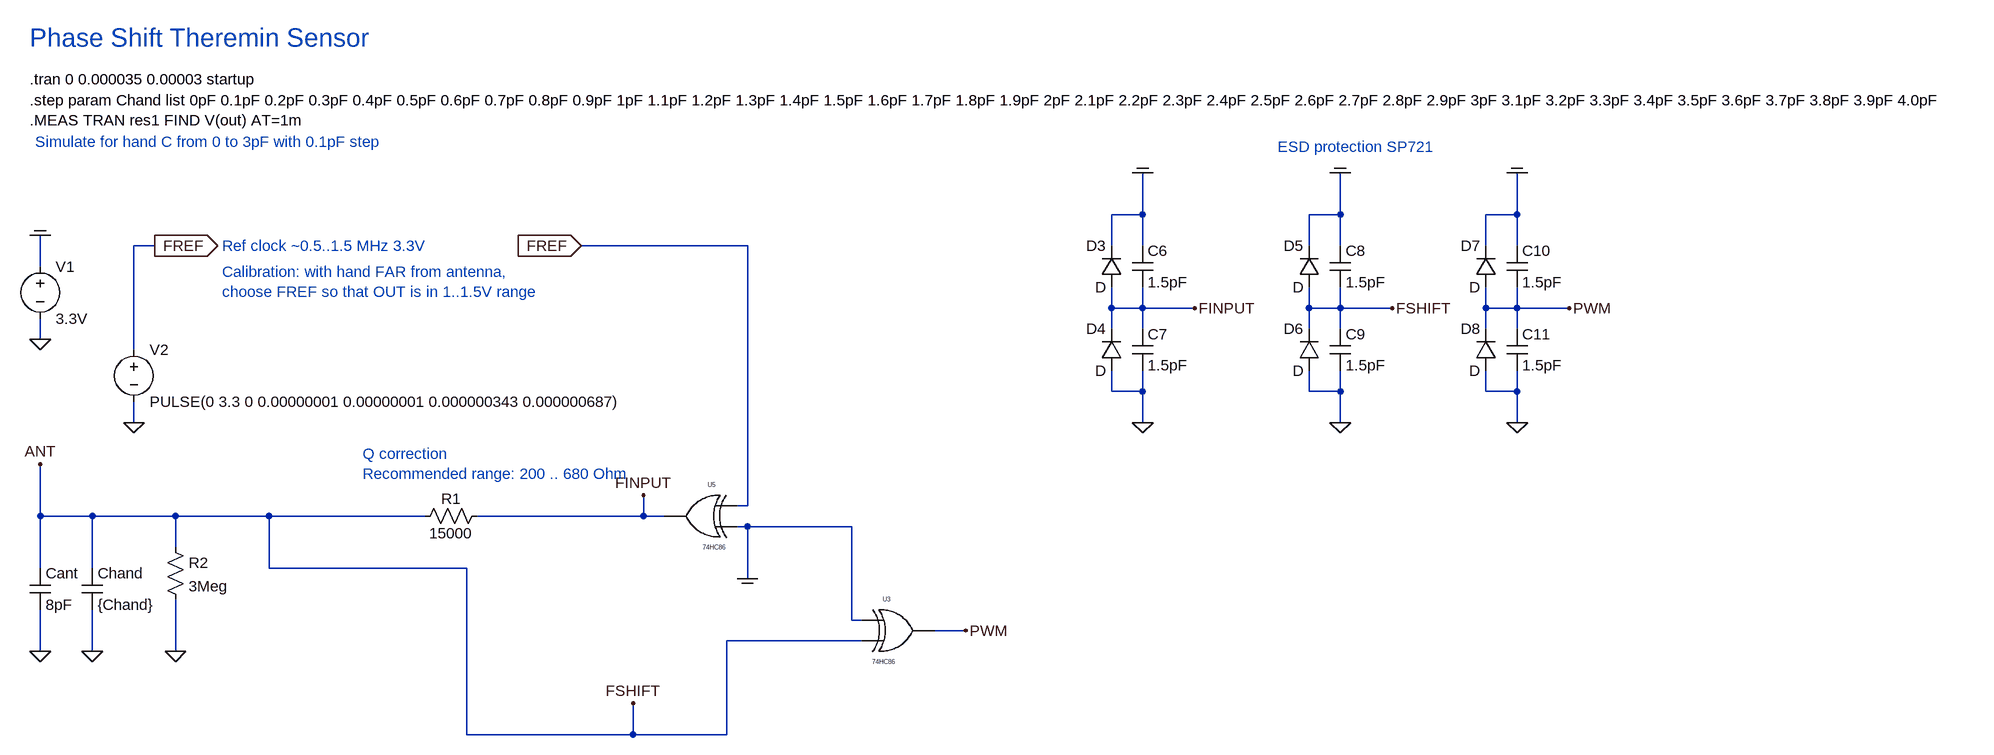
[diagram p0: schematic rc_sensor_v1.asc]
rc_sensor_v1.asc, the LTspice schematic file:
Version 4
SHEET 1 3724 1652
WIRE 1744 -96 1744 -160
WIRE 1744 -96 1696 -96
WIRE 2048 -96 2048 -160
WIRE 2048 -96 2000 -96
WIRE 2320 -96 2320 -160
WIRE 2320 -96 2272 -96
WIRE 224 -48 192 -48
WIRE 1136 -48 880 -48
WIRE 1696 -48 1696 -96
WIRE 1744 -48 1744 -96
WIRE 2000 -48 2000 -96
WIRE 2048 -48 2048 -96
WIRE 2272 -48 2272 -96
WIRE 2320 -48 2320 -96
WIRE 48 -16 48 -64
WIRE 1696 48 1696 16
WIRE 1744 48 1744 16
WIRE 1744 48 1696 48
WIRE 1824 48 1744 48
WIRE 2000 48 2000 16
WIRE 2048 48 2048 16
WIRE 2048 48 2000 48
WIRE 2128 48 2048 48
WIRE 2272 48 2272 16
WIRE 2320 48 2320 16
WIRE 2320 48 2272 48
WIRE 2400 48 2320 48
WIRE 1696 80 1696 48
WIRE 1744 80 1744 48
WIRE 2000 80 2000 48
WIRE 2048 80 2048 48
WIRE 2272 80 2272 48
WIRE 2320 80 2320 48
WIRE 48 96 48 64
WIRE 192 112 192 -48
WIRE 1696 176 1696 144
WIRE 1744 176 1744 144
WIRE 1744 176 1696 176
WIRE 2000 176 2000 144
WIRE 2048 176 2048 144
WIRE 2048 176 2000 176
WIRE 2272 176 2272 144
WIRE 2320 176 2320 144
WIRE 2320 176 2272 176
WIRE 192 224 192 192
WIRE 1744 224 1744 176
WIRE 2048 224 2048 176
WIRE 2320 224 2320 176
WIRE 1136 352 1136 -48
WIRE 1136 352 1120 352
WIRE 48 368 48 288
WIRE 128 368 48 368
WIRE 256 368 128 368
WIRE 400 368 256 368
WIRE 640 368 400 368
WIRE 976 368 976 336
WIRE 976 368 720 368
WIRE 1008 368 976 368
WIRE 1136 384 1120 384
WIRE 1296 384 1136 384
WIRE 256 416 256 368
WIRE 48 448 48 368
WIRE 128 448 128 368
WIRE 400 448 400 368
WIRE 704 448 400 448
WIRE 1136 464 1136 384
WIRE 1296 528 1296 384
WIRE 1312 528 1296 528
WIRE 1472 544 1424 544
WIRE 1312 560 1104 560
WIRE 48 576 48 512
WIRE 128 576 128 512
WIRE 256 576 256 496
WIRE 704 704 704 448
WIRE 960 704 960 656
WIRE 960 704 704 704
WIRE 1104 704 1104 560
WIRE 1104 704 960 704
FLAG 48 96 0
FLAG 224 -48 FREF
IOPIN 224 -48 Out
FLAG 192 224 0
FLAG 48 288 ANT
FLAG 48 576 0
FLAG 128 576 0
FLAG 1472 544 PWM
FLAG 880 -48 FREF
IOPIN 880 -48 In
FLAG 48 -64 COM
FLAG 1744 224 0
FLAG 1744 -160 COM
FLAG 1824 48 FINPUT
FLAG 2048 224 0
FLAG 2048 -160 COM
FLAG 2128 48 FSHIFT
FLAG 2320 224 0
FLAG 2320 -160 COM
FLAG 2400 48 PWM
FLAG 960 656 FSHIFT
FLAG 976 336 FINPUT
FLAG 256 576 0
FLAG 1136 464 COM
SYMBOL voltage 48 -32 R0
WINDOW 123 0 0 Left 2
WINDOW 39 0 0 Left 2
SYMATTR InstName V1
SYMATTR Value 3.3V
SYMBOL voltage 192 96 R0
WINDOW 123 0 0 Left 2
WINDOW 39 0 0 Left 2
SYMATTR InstName V2
SYMATTR Value PULSE(0 3.3 0 0.00000001 0.00000001 0.000000343 0.000000687)
SYMBOL cap 32 448 R0
SYMATTR InstName Cant
SYMATTR Value 8pF
SYMBOL cap 112 448 R0
SYMATTR InstName Chand
SYMATTR Value {Chand}
SYMBOL EXTRA\\74HC\\74hc86 1360 480 R0
SYMATTR InstName U3
SYMATTR SpiceLine VCC=3.3  SPEED=1.0  TRIPDT=1e-9
SYMBOL res 736 352 R90
WINDOW 0 5 56 VBottom 2
WINDOW 3 27 56 VTop 2
SYMATTR InstName R1
SYMATTR Value 15000
SYMBOL diode 1712 16 R180
WINDOW 0 24 64 Left 2
WINDOW 3 24 0 Left 2
SYMATTR InstName D3
SYMBOL diode 1712 144 R180
WINDOW 0 24 64 Left 2
WINDOW 3 24 0 Left 2
SYMATTR InstName D4
SYMBOL cap 1728 -48 R0
SYMATTR InstName C6
SYMATTR Value 1.5pF
SYMBOL cap 1728 80 R0
SYMATTR InstName C7
SYMATTR Value 1.5pF
SYMBOL diode 2016 16 R180
WINDOW 0 24 64 Left 2
WINDOW 3 24 0 Left 2
SYMATTR InstName D5
SYMBOL diode 2016 144 R180
WINDOW 0 24 64 Left 2
WINDOW 3 24 0 Left 2
SYMATTR InstName D6
SYMBOL cap 2032 -48 R0
SYMATTR InstName C8
SYMATTR Value 1.5pF
SYMBOL cap 2032 80 R0
SYMATTR InstName C9
SYMATTR Value 1.5pF
SYMBOL diode 2288 16 R180
WINDOW 0 24 64 Left 2
WINDOW 3 24 0 Left 2
SYMATTR InstName D7
SYMBOL diode 2288 144 R180
WINDOW 0 24 64 Left 2
WINDOW 3 24 0 Left 2
SYMATTR InstName D8
SYMBOL cap 2304 -48 R0
SYMATTR InstName C10
SYMATTR Value 1.5pF
SYMBOL cap 2304 80 R0
SYMATTR InstName C11
SYMATTR Value 1.5pF
SYMBOL res 240 400 R0
SYMATTR InstName R2
SYMATTR Value 3Meg
SYMBOL EXTRA\\74HC\\74hc86 1072 304 M0
SYMATTR InstName U5
SYMATTR SpiceLine VCC=3.3  SPEED=1.0  TRIPDT=1e-9
TEXT 32 -304 Left 2 !.tran 0 0.000035 0.00003 startup
TEXT 32 -272 Left 2 !.step param Chand list 0pF 0.1pF 0.2pF 0.3pF 0.4pF 0.5pF 0.6pF 0.7pF 0.8pF 0.9pF 1pF 1.1pF 1.2pF 1.3pF 1.4pF 1.5pF 1.6pF 1.7pF 1.8pF 1.9pF 2pF 2.1pF 2.2pF 2.3pF 2.4pF 2.5pF 2.6pF 2.7pF 2.8pF 2.9pF 3pF 3.1pF 3.2pF 3.3pF 3.4pF 3.5pF 3.6pF 3.7pF 3.8pF 3.9pF 4.0pF\n.MEAS TRAN res1 FIND V(out) AT=1m
TEXT 328 -48 Left 2 ;Ref clock ~0.5..1.5 MHz 3.3V
TEXT 32 -368 Left 4 ;Phase Shift Theremin Sensor
TEXT 544 272 Left 2 ;Q correction\nRecommended range: 200 .. 680 Ohm
TEXT 1952 -200 Left 2 ;ESD protection SP721
TEXT 328 -8 Left 2 ;Calibration: with hand FAR from antenna,\nchoose FREF so that OUT is in 1..1.5V range
TEXT 40 -208 Left 2 ;Simulate for hand C from 0 to 3pF with 0.1pF step

The netlist it stands for:
* rc_sensor_v1.asc
V1 COM 0 3.3V
V2 FREF 0 PULSE(0 3.3 0 0.00000001 0.00000001 0.000000343 0.000000687)
Cant FSHIFT 0 8pF
Chand FSHIFT 0 {Chand}
XU3 COM FSHIFT PWM VCC 0 74HC86 VCC=3.3  SPEED=1.0  TRIPDT=1e-9  ; pins A B Y
R1 FINPUT FSHIFT 15000
D3 FINPUT COM D
D4 0 FINPUT D
C6 COM FINPUT 1.5pF
C7 FINPUT 0 1.5pF
D5 FSHIFT COM D
D6 0 FSHIFT D
C8 COM FSHIFT 1.5pF
C9 FSHIFT 0 1.5pF
D7 PWM COM D
D8 0 PWM D
C10 COM PWM 1.5pF
C11 PWM 0 1.5pF
R2 FSHIFT 0 3Meg
XU5 FREF COM FINPUT VCC 0 74HC86 VCC=3.3  SPEED=1.0  TRIPDT=1e-9  ; pins A B Y
.model D D
.lib standard.dio
.tran 0 0.000035 0.00003 startup
.step param Chand list 0pF 0.1pF 0.2pF 0.3pF 0.4pF 0.5pF 0.6pF 0.7pF 0.8pF 0.9pF 1pF 1.1pF 1.2pF 1.3pF 1.4pF 1.5pF 1.6pF 1.7pF 1.8pF 1.9pF 2pF 2.1pF 2.2pF 2.3pF 2.4pF 2.5pF 2.6pF 2.7pF 2.8pF 2.9pF 3pF 3.1pF 3.2pF 3.3pF 3.4pF 3.5pF 3.6pF 3.7pF 3.8pF 3.9pF 4.0pF
.MEAS TRAN res1 FIND V(out) AT=1m
* Ref clock ~0.5..1.5 MHz 3.3V
* Phase Shift Theremin Sensor
* Q correction
* Recommended range: 200 .. 680 Ohm
* ESD protection SP721
* Calibration: with hand FAR from antenna,
* choose FREF so that OUT is in 1..1.5V range
* Simulate for hand C from 0 to 3pF with 0.1pF step
.lib 74HC.lib
.backanno
.end